# EAGLE design MPPT (EAGLE 7.1.0)
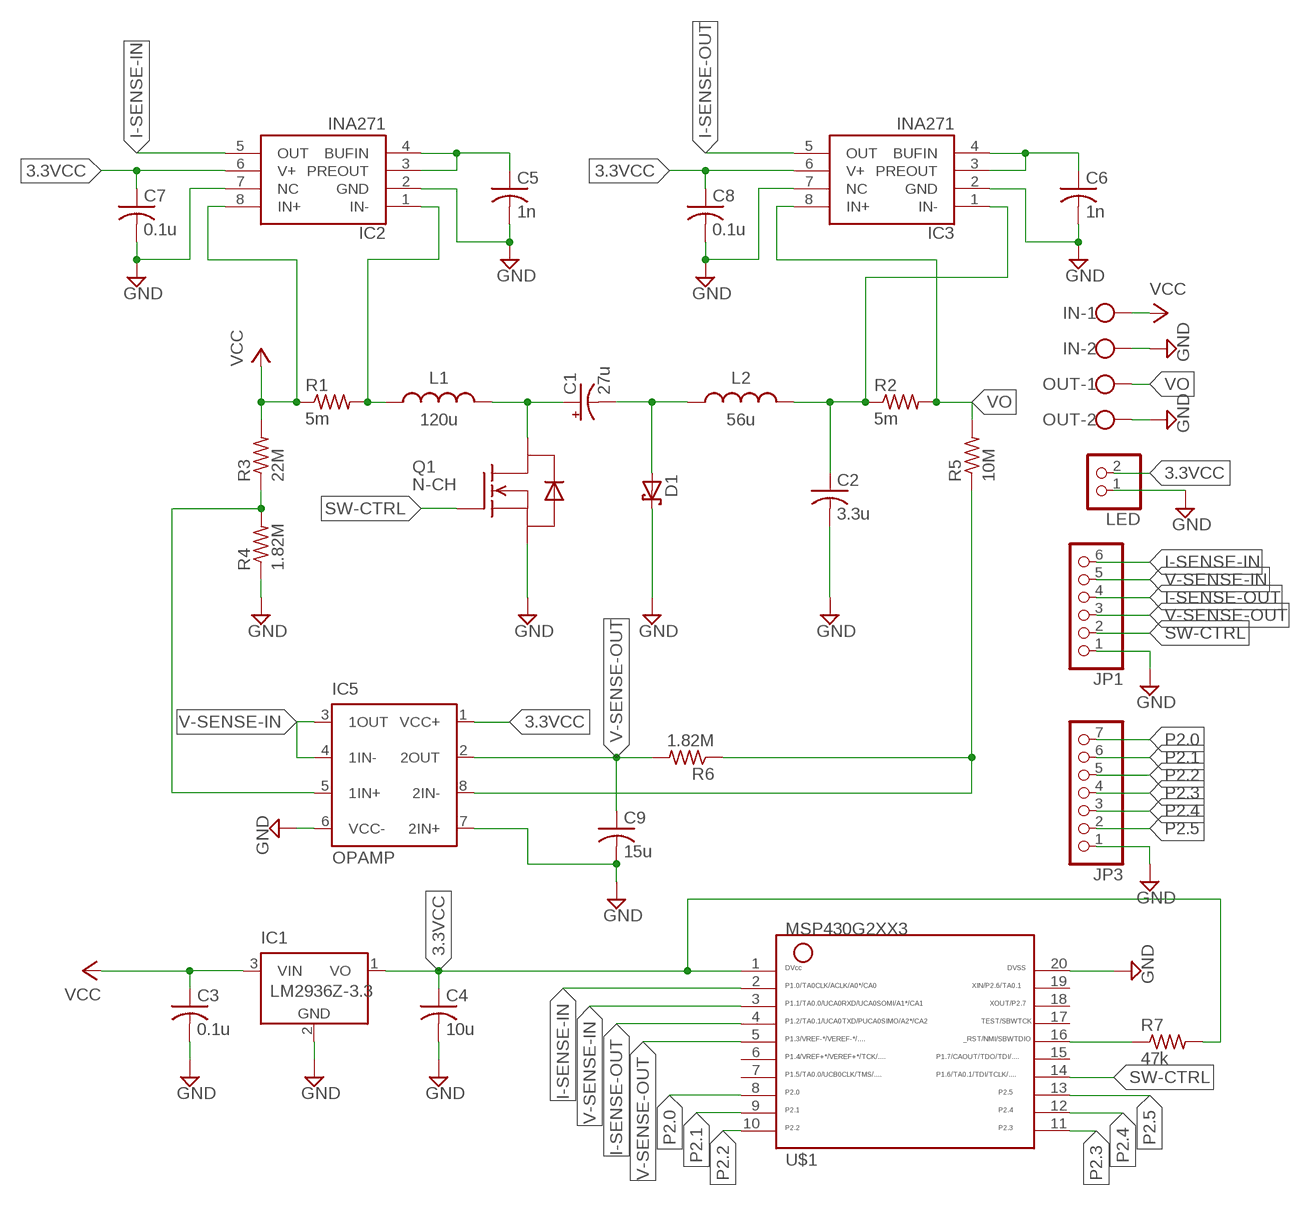
[diagram p0: schematic, sheet 1]

## Parts
C1  27u  CPOL-USE3.5-8  [E3,5-8]
C2  3.3u  C-US025-030X050  [C02,5-03,5X05,5]
C3  0.1u  C-US050-024X044  [C050-024X044]
C4  10u  C-US025-024X044  [C025-024X044]
C5  1n  C-US050-045X075  [C050-045X075]
C6  1n  C-US050-045X075  [C050-045X075]
C7  0.1u  C-US050-024X044  [C050-024X044]
C8  0.1u  C-US050-024X044  [C050-024X044]
C9  15u  C-US050-024X044  [C050-024X044]
D1  SCHOTTKY-DIODEVERTICAL  [TO220ACS]
IC1  LM2936Z-3.3  [TO92]
IC2  INA271  INA271AIDR-CURRENT-SENSE  [SO08]
IC3  INA271  INA271AIDR-CURRENT-SENSE  [SO08]
IC5  OPAMP  RC4558-OPAMP  [DIL08]
IN  W237-102  [W237-102]
JP1  PINHD-1X6  [1X06]
JP3  PINHD-1X7  [1X07]
L1  120u  IND-120UH-1140-121K-RC  [IND-1140-121K-RC]
L2  56u  IND-56UH-2310-RCVERTICAL  [IND-2310-RC-VERT]
LED  PINHD-1X2  [1X02]
OUT  W237-102  [W237-102]
Q1  N-CH  BUK6507-75C-N-MOSFETVERTICAL  [TO220-VERT]
R1  5m  R-US_  [BR3-CURRENT-SENSE]
R2  5m  R-US_  [BR3-CURRENT-SENSE]
R3  22M  R-US_0309/12  [0309/12]
R4  1.82M  R-US_0207/10  [0207/10]
R5  10M  R-US_0309/12  [0309/12]
R6  1.82M  R-US_0207/10  [0207/10]
R7  47k  R-US_0207/7  [0207/7]
U$1  G2553  G2XX3---N20  [N20]

## Nets
3.3VCC: C4.1 C7.1 C8.1 IC1.1(VO) IC2.6(V+) IC3.6(V+) IC5.1(VCC+) LED.2 R7.2 U$1.1
GND [Load]: C2.2 C3.2 C4.2 C5.2 C6.2 C7.2 C8.2 C9.2 D1.C IC1.2(GND) IC2.2(GND) IC2.7(NC) IC3.2(GND) IC3.7(NC) IC5.6(VCC-) IC5.7(2IN+) IN.2 JP1.1 JP3.1 LED.1 OUT.2 Q1.P$3(S) R4.1 U$1.20
I-SENSE-IN: IC2.5(OUT) JP1.6 U$1.2
I-SENSE-OUT: IC3.5(OUT) JP1.4 U$1.4
N$1 [Load]: C1.+ L1.P$2 Q1.P$2(D)
N$2 [Load]: C1.- D1.A L2.P$1
N$3: R7.1 U$1.16
N$4: IC5.5(1IN+) R3.1 R4.2
N$5: IC5.8(2IN-) R5.1 R6.1
N$6 [Load]: IC2.1(IN-) L1.P$1 R1.P$2
N$7 [Load]: C2.1 IC3.1(IN-) L2.P$2 R2.P$1
N$9: C5.1 IC2.3(PREOUT) IC2.4(BUFIN)
N$10: C6.1 IC3.3(PREOUT) IC3.4(BUFIN)
P2.0: JP3.7 U$1.8
P2.1: JP3.6 U$1.9
P2.2: JP3.5 U$1.10
P2.3: JP3.4 U$1.11
P2.4: JP3.3 U$1.12
P2.5: JP3.2 U$1.13
SW-CTRL: JP1.2 Q1.P$1(G) U$1.14
V-SENSE-IN: IC5.3(1OUT) IC5.4(1IN-) JP1.5 U$1.3
V-SENSE-OUT: C9.1 IC5.2(2OUT) JP1.3 R6.2 U$1.5
VCC [Load]: C3.1 IC1.3(VIN) IC2.8(IN+) IN.1 R1.P$1 R3.2
VO [Load]: IC3.8(IN+) OUT.1 R2.P$2 R5.2
Unconnected: U$1.6 U$1.7 U$1.15 U$1.17 U$1.18 U$1.19

## Library data of the parts
C1 = MPPT:CPOL-US: POLARIZED CAPACITOR, American symbol
C2-C4 C7 C8 = MPPT:C-US: CAPACITOR, American symbol
C5 C6 C9 = rcl:C-US: CAPACITOR, American symbol
D1 = MPPT:SCHOTTKY-DIODE: Schottky Diode
IC1 = national-semiconductor:LM2936?*: Ultra-Low Quiescent Current LDO Voltage Regulator Source: Data sheet <http://www.national.com/ds/LM/LM2936.pdf>; MF: NATIONAL SEMICONDUCTOR; MPN: LM2936Z-3.3/NOPB; OC_FARNELL: 1564641; OC_NEWARK: 41K4532
IC2 IC3 = MPPT:INA271AIDR-CURRENT-SENSE: Single Port USB Power Switch and Over-Current Protection HIGH active Source: http://cache.national.com/ds/LM/LM3525.pdf
IC5 = MPPT:RC4558-OPAMP: Dual General-Purpose Operational Amplifier; MF: TEXAS INSTRUMENTS; MPN: RC4558P
IN OUT = con-wago-500:W237-102: WAGO SCREW CLAMP; MPN: 237-102; OC_FARNELL: unknown; OC_NEWARK: 70K9898
JP1 = pinhead:PINHD-1X6: PIN HEADER
JP3 = pinhead:PINHD-1X7: PIN HEADER
L1 = MPPT:IND-120UH-1140-121K-RC
L2 = MPPT:IND-56UH-2310-RC
LED = pinhead:PINHD-1X2: PIN HEADER
Q1 = MPPT:BUK6507-75C-N-MOSFET: N-Channel Enhancement MOSFET 50V; 20A; 0,080Ohm
R1-R6 = MPPT:R-US_: RESISTOR, American symbol
R7 = rcl:R-US_: RESISTOR, American symbol
U$1 = TI_MSP430_v16:G2XX3---N20: MSP430G2XX1 PDIP (N) 20 Pin Package

## Net classes
0 Data: width 0.254 mm, drill 0.33 mm
1 Load: width 2.642 mm, drill 0.33 mm, clearance 0.61 mm

## Board
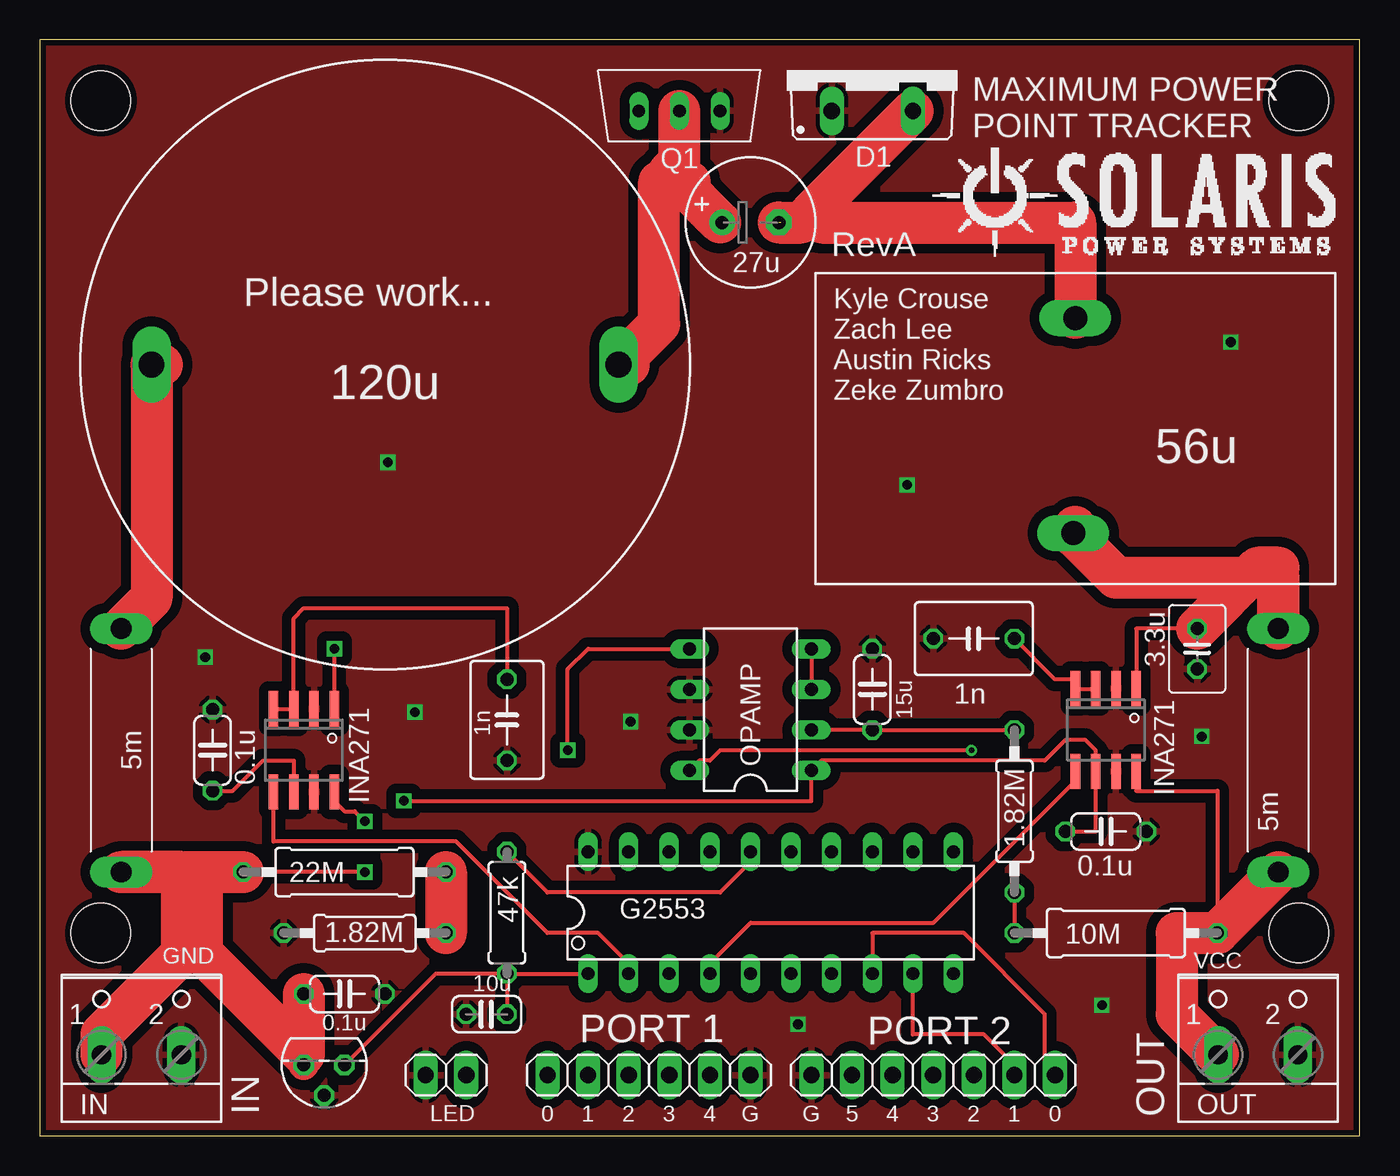
[diagram p1: board, top side]
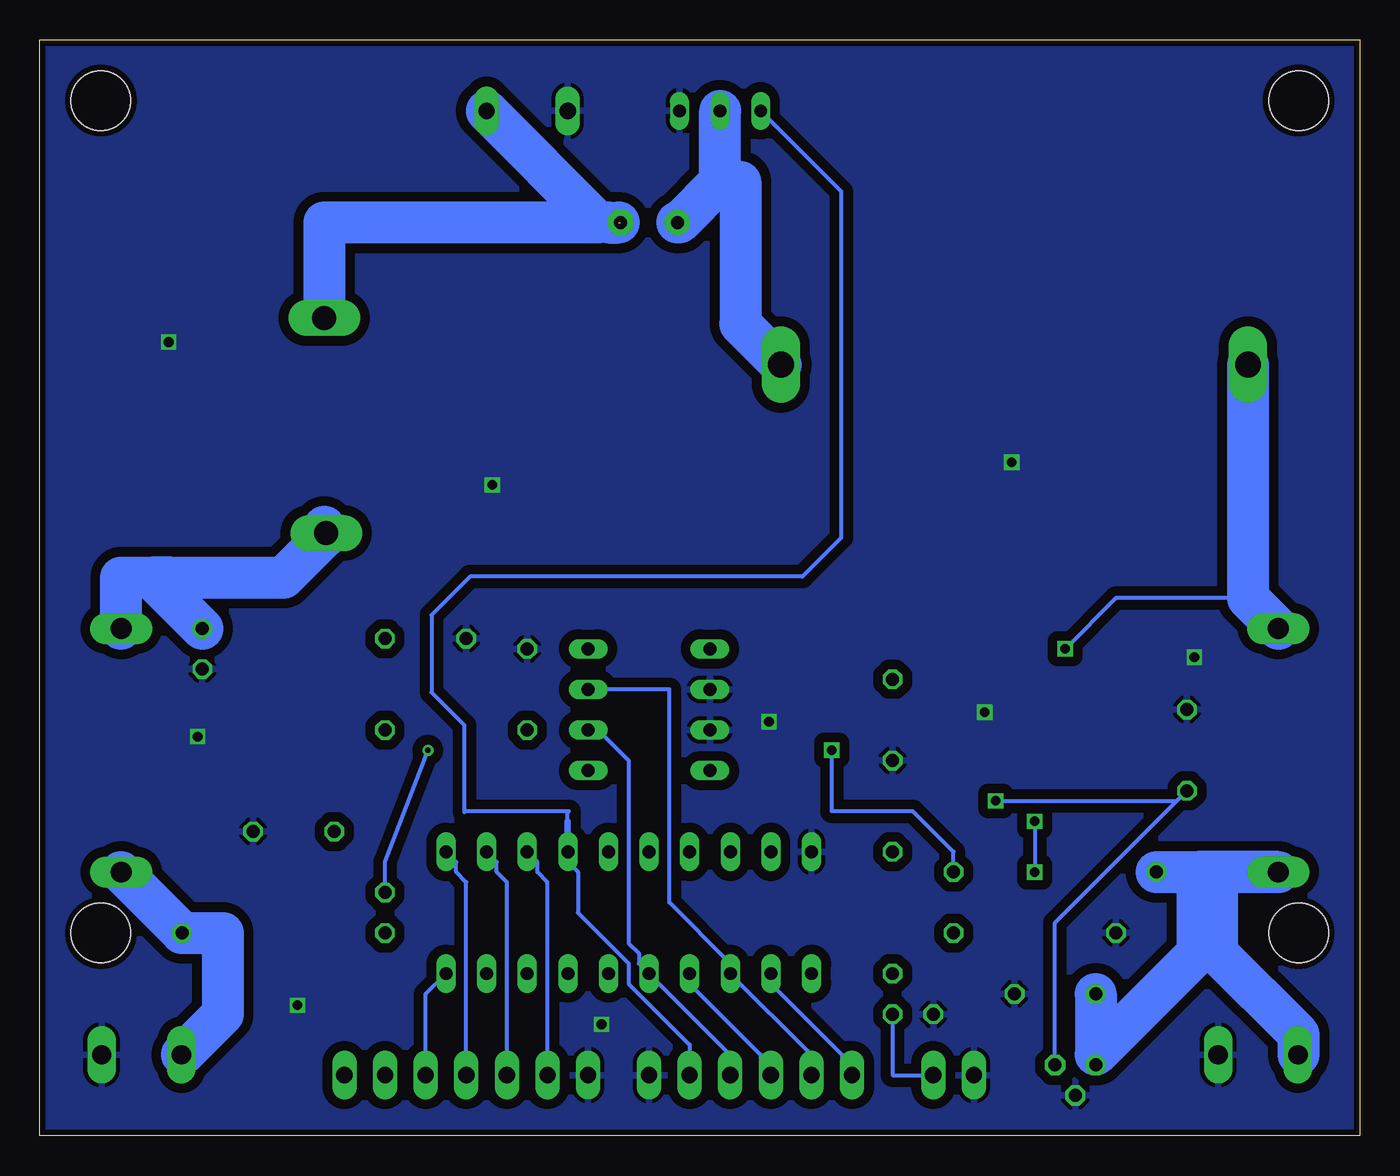
[diagram p2: board, bottom side, seen from below]

Size 82.55 x 68.57 mm. Coordinates in mm from the lower left corner, seen from the top.
Outline: 0,0 82.55,0 82.55,68.57 0,68.57 0,0
Copper layers (1*16): Top 0.0356mm / dielectric 1.5011mm / Bottom 0.0356mm
Design rules "OshPark": minimum track width 6mil, minimum drill 13mil, track to track 6mil, track to pad 6mil, pad to pad 6mil, via to via 6mil, smd to smd 6mil, copper to edge 15mil, drill to drill 6mil, minimum pad ring 7mil, minimum via ring 7mil, stop-mask expansion 3mil, vias tented up to drill 0mil, thermal gap 10mil
Holes 3.71 mm at 3.81,64.77 3.81,12.7 78.74,12.7 78.74,64.77

### Footprints (pad centres in the part's own frame; a part is rotated, then mirrored left to right if it is on the bottom)
E3,5-8 = drill 0.813 pad 1.6: + -1.778,0 | drill 0.813 pad 1.6 octagon: - 1.778,0
C02,5-03,5X05,5 = drill 0.813 octagon: 1 -1.27,0; 2 1.27,0
C050-024X044 = drill 0.813 octagon: 1 -2.54,0; 2 2.54,0
C025-024X044 = drill 0.813 octagon: 1 -1.27,0; 2 1.27,0
C050-045X075 = drill 0.813 octagon: 1 -2.54,0; 2 2.54,0
TO220ACS = drill 1.016 long: A 2.54,-2.54; C -2.54,-2.54
TO92 = drill 0.813 pad 1.27 octagon: 1 -1.27,0; 2 0,1.905; 3 1.27,0
SO08 = smd 0.6 x 2.2: 1 -1.905,-2.6; 2 -0.635,-2.6; 3 0.635,-2.6; 4 1.905,-2.6; 5 1.905,2.6; 6 0.635,2.6; 7 -0.635,2.6; 8 -1.905,2.6
DIL08 = drill 0.813 long: 1 -3.81,-3.81; 2 -1.27,-3.81; 3 1.27,-3.81; 4 3.81,-3.81; 5 3.81,3.81; 6 1.27,3.81; 7 -1.27,3.81; 8 -3.81,3.81
W237-102 = drill 1.194 long: 1 -2.5,-1.27; 2 2.5,-1.27
1X06 = drill 1.016 long: 1 -6.35,0; 2 -3.81,0; 3 -1.27,0; 4 1.27,0; 5 3.81,0; 6 6.35,0
1X07 = drill 1.016 long: 1 -7.62,0; 2 -5.08,0; 3 -2.54,0; 4 0,0; 5 2.54,0; 6 5.08,0; 7 7.62,0
IND-1140-121K-RC = drill 1.6 long: P$1 -14.605,0; P$2 14.605,0
IND-2310-RC-VERT = drill 1.5 long: P$1 -6.731,0; P$2 6.731,-0.127
1X02 = drill 1.016 long: 1 -1.27,0; 2 1.27,0
TO220-VERT = drill 0.8 long: P$1 2.54,0; P$2 0,0; P$3 -2.54,0
BR3-CURRENT-SENSE = drill 1.3 long: P$1 7.62,0; P$2 -7.62,0
0309/12 = drill 0.813 octagon: 1 -6.35,0; 2 6.35,0
0207/10 = drill 0.813 octagon: 1 -5.08,0; 2 5.08,0
0207/7 = drill 0.813 octagon: 1 -3.81,0; 2 3.81,0
N20 = drill 0.813 long: 1 -11.435,-3.81; 2 -8.895,-3.81; 3 -6.355,-3.81; 4 -3.815,-3.81; 5 -1.275,-3.81; 6 1.265,-3.81; 7 3.805,-3.81; 8 6.345,-3.81; 9 8.885,-3.81; 10 11.425,-3.81; 11 11.425,3.81; 12 8.885,3.81; 13 6.345,3.81; 14 3.805,3.81; 15 1.265,3.81; 16 -1.275,3.81; 17 -3.815,3.81; 18 -6.355,3.81; 19 -8.895,3.81; 20 -11.435,3.81

### Placement (x,y rotation side)
C1  44.45,57.15 0 top
C2  72.39,30.48 270 top
C3  19.05,8.89 0 top
C4  27.94,7.62 180 top
C5  29.21,26.04 270 top
C6  58.42,31.11 180 top
C7  66.67,19.05 0 top
C8  10.79,24.13 90 top
C9  52.07,27.94 90 top
D1  52.07,66.67 0 top
IC1  17.78,4.45 180 top
IC2  16.51,24.13 180 top
IC3  66.67,25.4 180 top
IC5  44.45,26.67 90 top
IN  6.35,6.35 0 top
JP1  38.1,3.81 180 top
JP3  55.88,3.81 0 top
L1  21.59,48.26 0 top
L2  64.77,44.45 270 top
LED  25.4,3.81 0 top
OUT  76.2,6.35 0 top
Q1  40.01,64.14 180 top
R1  5.08,24.13 270 top
R2  77.47,24.13 90 top
R3  19.05,16.51 180 top
R4  20.32,12.7 0 top
R5  67.31,12.7 0 top
R6  60.96,20.32 90 top
R7  29.21,13.97 270 top
U$1  45.72,13.97 0 top

### Tracks (layer width: path | path; a pad name or v marks a point on that pad's centre or on a via)
3.3VCC  (via drill 0.6)
  Top 0.254: C7.1 66.04,19.05 IC3.6 66.04,24.13 65.41,24.77 64.14,24.77 62.87,23.5 48.9,23.5 IC5.1 48.26,20.95 22.78,20.95 v22.77,20.97 | IC2.6 15.88,23.5 13.97,23.5 12.06,21.59 C8.1 | R7.2 C4.1 | R7.2 U$1.1 | IC1.1 24.77,10.16 R7.2
  Bottom 0.254: LED.2 29.21,3.81 C4.1 | IC1.1 19.05,13.34 C8.1 11.42,20.97 v22.77,20.97
GND  (via drill 0.6)
  other vias: 21.77,42.15 74.5,49.67 54.25,40.73 23.46,26.5 36.94,25.92 66.43,8.18 47.42,6.99 10.34,29.95 72.68,24.99
  pour Bottom: -1.45,69.82 83.43,68.77 83.6,-2.32 -1.27,-1.27
  pour Top: -1.45,69.66 83.62,68.78 83.79,-2.15 -1.27,-1.27
I-SENSE-IN
  Top 0.254: IC2.5 14.61,18.41 26.04,18.41 31.75,12.7 34.92,12.7 36.83,10.79 U$1.2
  Bottom 0.254: JP1.6 32.38,4.45 32.38,5.08 36.83,9.53 U$1.2
I-SENSE-OUT
  Top 0.254: IC3.5 64.77,22.23 55.88,13.34 44.45,13.34 41.91,10.79 U$1.4
  Bottom 0.254: JP1.4 37.47,4.45 37.47,5.08 41.91,9.53 U$1.4
N$1
  Top 2.642: 36.83,48.26 36.83,48.9 38.73,50.8 38.73,59.69 39.37,59.69 | 39.37,59.69 40.01,59.69 | 42.55,57.15 40.01,59.69 | 40.64,59.69 40.01,59.69 | 39.37,59.69 39.37,60.33 40.01,60.96 Q1.P$2
  Bottom 2.642: 40.01,59.69 Q1.P$2 | 40.01,59.69 42.55,57.15 C1.+ | L1.P$2 38.73,50.8 38.73,59.69 40.01,59.69
N$2  (1 unrouted)
  Top 2.642: 48.26,57.78 47.62,57.15 C1.- | 48.26,57.78 D1.A | L2.P$1 64.77,57.15 48.9,57.15 48.26,57.78
  Bottom 2.642: D1.A 47.62,57.15 64.77,57.15 64.77,51.44 | 46.99,57.15 46.35,57.15
N$3
  Top 0.254: R7.1 31.75,15.24 42.55,15.24 44.45,17.14 U$1.16
N$4  (via drill 0.6)
  Top 0.254: v33.02,24.13 33.02,29.21 34.29,30.48 IC5.5
  Top 2.642: R3.1 R4.2
  Bottom 0.254: R3.1 25.4,17.78 27.94,20.32 33.02,20.32 v33.02,24.13
N$5  (via drill 0.33)
  Top 0.254: R6.1 R5.1 | IC5.8 41.27,23.5 41.91,23.5 42.55,24.13 v58.28,24.13
  Bottom 0.254: v58.28,24.13 60.96,17.14 R6.1
N$6  (via drill 0.6)
  Top 0.254: v18.41,30.48 IC2.1
  Top 2.642: 7.62,48.26 L1.P$1 6.99,33.66 R1.P$2
  Bottom 0.254: 6.99,33.66 15.24,33.66 v18.41,30.48
  Bottom 2.642: L1.P$1 6.99,33.66 R1.P$2
N$7
  Top 0.254: C2.1 68.58,31.75 IC3.1
  Top 2.642: 64.77,38.1 64.77,37.47 67.31,34.92 77.47,34.92 R2.P$1 77.47,35.56 76.2,35.56 C2.1
  Bottom 2.642: 75.56,34.92 74.93,34.29 | 74.93,34.29 C2.1 74.93,34.29 | 74.3,34.92 67.31,34.92 64.77,37.47 | 64.77,37.47 L2.P$2 | 74.3,34.92 74.93,34.29 | 64.77,38.1 64.77,37.47 | 74.3,34.92 75.56,34.92 | R2.P$1 77.47,34.92 75.56,34.92
N$9
  Top 0.254: IC2.4 14.61,26.67 15.88,26.67 IC2.3 15.88,32.38 16.51,33.02 29.21,33.02 C5.1
N$10
  Top 0.254: IC3.3 66.04,27.94 64.77,27.94 IC3.4 64.77,28.57 63.5,28.57 C6.1
P2.0
  Top 0.254: JP3.7 62.87,3.81 62.87,7.62 57.78,12.7 52.07,12.7 U$1.8
P2.1
  Top 0.254: JP3.6 60.96,4.45 59.05,6.35 54.61,6.35 U$1.9
P2.2
  Bottom 0.254: JP3.5 58.42,8.89 U$1.10
P2.3
  Bottom 0.254: JP3.4 55.88,15.88 56.52,16.51 56.52,17.14 U$1.11
P2.4
  Bottom 0.254: JP3.3 53.34,15.88 53.98,16.51 53.98,17.14 U$1.12
P2.5
  Bottom 0.254: JP3.2 50.8,15.88 51.44,16.51 51.44,17.14 U$1.13
SW-CTRL
  Bottom 0.254: U$1.14 49.53,18.41 | JP1.2 41.91,5.71 45.72,9.53 45.72,10.79 48.9,13.97 48.9,16.51 49.53,17.14 U$1.14 | U$1.14 | 49.53,19.68 49.53,20.24 49.45,20.32 55.94,20.32 55.99,20.27 55.99,25.69 58.05,27.75 58.05,32.59 55.65,34.99 34.86,34.99 32.42,37.43 32.42,59.09 Q1.P$1
  Bottom 0.406: 49.53,18.41 49.53,19.68
V-SENSE-IN
  Top 0.254: IC5.4 IC5.3
  Bottom 0.254: U$1.3 34.29,5.08 JP1.5 | IC5.3 43.18,27.94 43.18,14.61 39.37,10.79 U$1.3 | U$1.3
V-SENSE-OUT
  Top 0.254: IC5.2 C9.1 R6.2
  Bottom 0.254: U$1.5 39.37,5.08 JP1.3 | U$1.5 45.09,10.79 45.09,11.43 45.72,12.06 45.72,23.5 47.62,25.4 IC5.2 | U$1.5
VCC  (via drill 0.6)
  Top 0.254: IC2.8 18.41,20.95 19.05,20.32 19.68,20.32 v20.32,19.68 | v20.32,16.51 R3.2
  Top 1.905: IC1.3 16.51,5.08
  Top 2.642: IN.1 3.85,6.39 8.89,11.43 8.89,16.51 R1.P$1 10.16,16.51 | 10.16,16.51 R3.2 | 10.16,16.51 10.16,11.43 16.51,5.08 C3.1
  Bottom 0.254: v20.32,19.68 v20.32,16.51
  Bottom 2.642: 3.81,5.08 3.81,6.35 8.89,11.43 8.89,16.51 R1.P$1 10.16,16.51 | R3.2 10.16,16.51 | 10.16,16.51 10.16,11.43 16.51,5.08 C3.1
VO
  Top 0.254: IC3.8 68.58,21.59 73.66,21.59 R5.2
  Top 2.642: R2.P$2 R5.2 71.12,12.7 71.12,7.62 73.66,5.08 OUT.1
  Bottom 2.642: R2.P$2 R5.2 71.12,12.7 71.12,7.62 73.66,5.08

### Text on the board
tPlace: MAXIMUM POWER / POINT TRACKER | RevA | Please work... | Kyle Crouse / Zach Lee / Austin Ricks / Zeke Zumbro | GND | VCC | PORT 1 | PORT 2 | IN | 0 | 1 | 2 | 3 | 4 | G | G | 5 | 4 | 3 | 2 | 1 | 0 | OUT